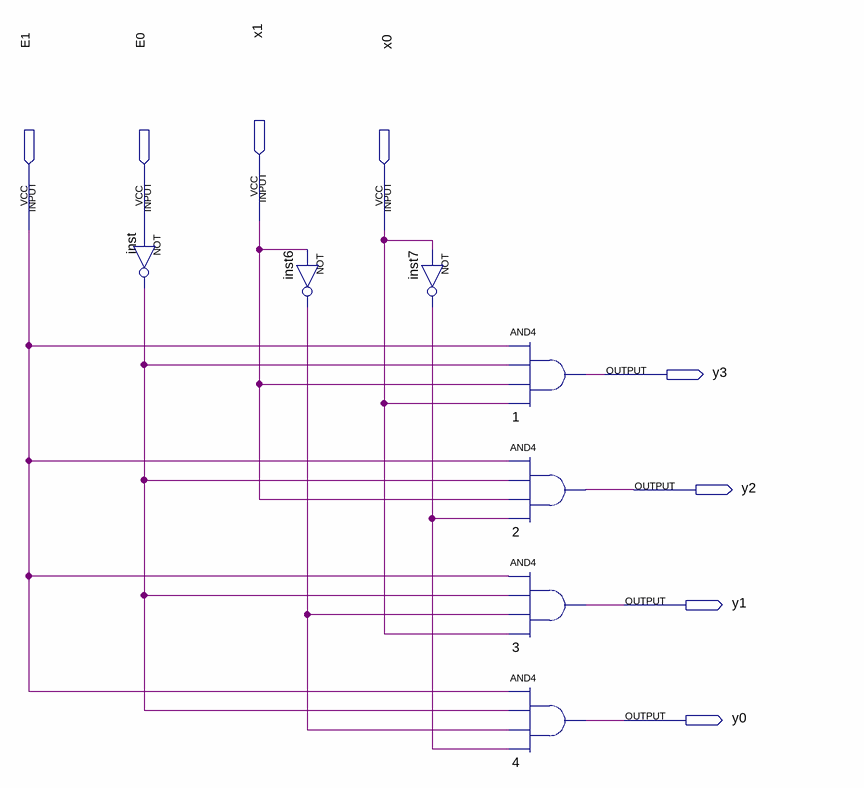
[diagram p0: schematic sheet]
// Quartus schematic Dec2_4.bdf as structural Verilog: 7 symbols, 8 pins
module Dec2_4 (
  input  x1,
  input  E1,
  input  E0,
  input  x0,
  output y3,
  output y2,
  output y1,
  output y0
);

  wire inst6_out, inst7_out, inst_out;

  not inst (inst_out, E0);
  not inst6 (inst6_out, x1);
  not inst7 (inst7_out, x0);
  and u_1 (y3, E1, inst_out, x1, x0);
  and u_2 (y2, E1, inst_out, x1, inst7_out);
  and u_3 (y1, E1, inst_out, inst6_out, x0);
  and u_4 (y0, E1, inst_out, inst6_out, inst7_out);
endmodule
